# Altium project PowerStuff.PrjPcb
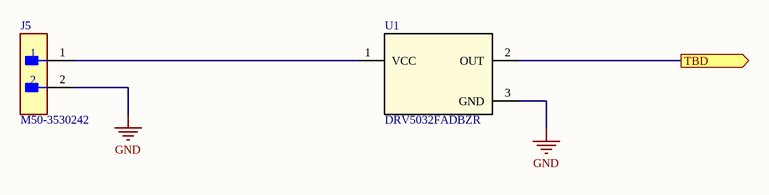
[diagram p0: HallSensor.SchDoc]
4 sheets, 56 parts. Net scope: flat (ports and power ports of the same name join across sheets).
Sheets:
  HallSensor.SchDoc
  ChargerIC.SchDoc
  Boost.SchDoc
  MotorDriver.SchDoc

## Sheet HallSensor.SchDoc
size A4; SheetNumber: 1; SheetTotal: 3

### Parts
J5  M50-3530242  [FP-M50-3530242-MFG]
U1  DRV5032FADBZR  [DBZ0003A-IPC_A]

### Ports
TBD (out)

### Nets
GND: J5.2 U1.3(GND)  [project net ADAPTER-]
NetJ5_1: J5.1 U1.1(VCC)
NetU1_2: U1.2(OUT) ; port TBD

### Library data of the parts
J5 = CMP-15831-000040-1: CONN HEADER VERT 2POS 1.27MM
U1 = DRV5032FADBZR: Low-power (5Hz, <1ÂµA) low-voltage (up to 5.5V) switch 3-SOT-23 -40 to 85; Manufacturer_Name: Texas Instruments; TYPE: TYPE; RefDes: RefDes; Copyright: Copyright (C) 2026 Ultra Librarian. All rights reserved.; Manufacturer_Part_Number: DRV5032FADBZR; Datasheet: https://www.ti.com/lit/gpn/drv5032

## Sheet ChargerIC.SchDoc
size A4; SheetNumber: 2; SheetTotal: 4
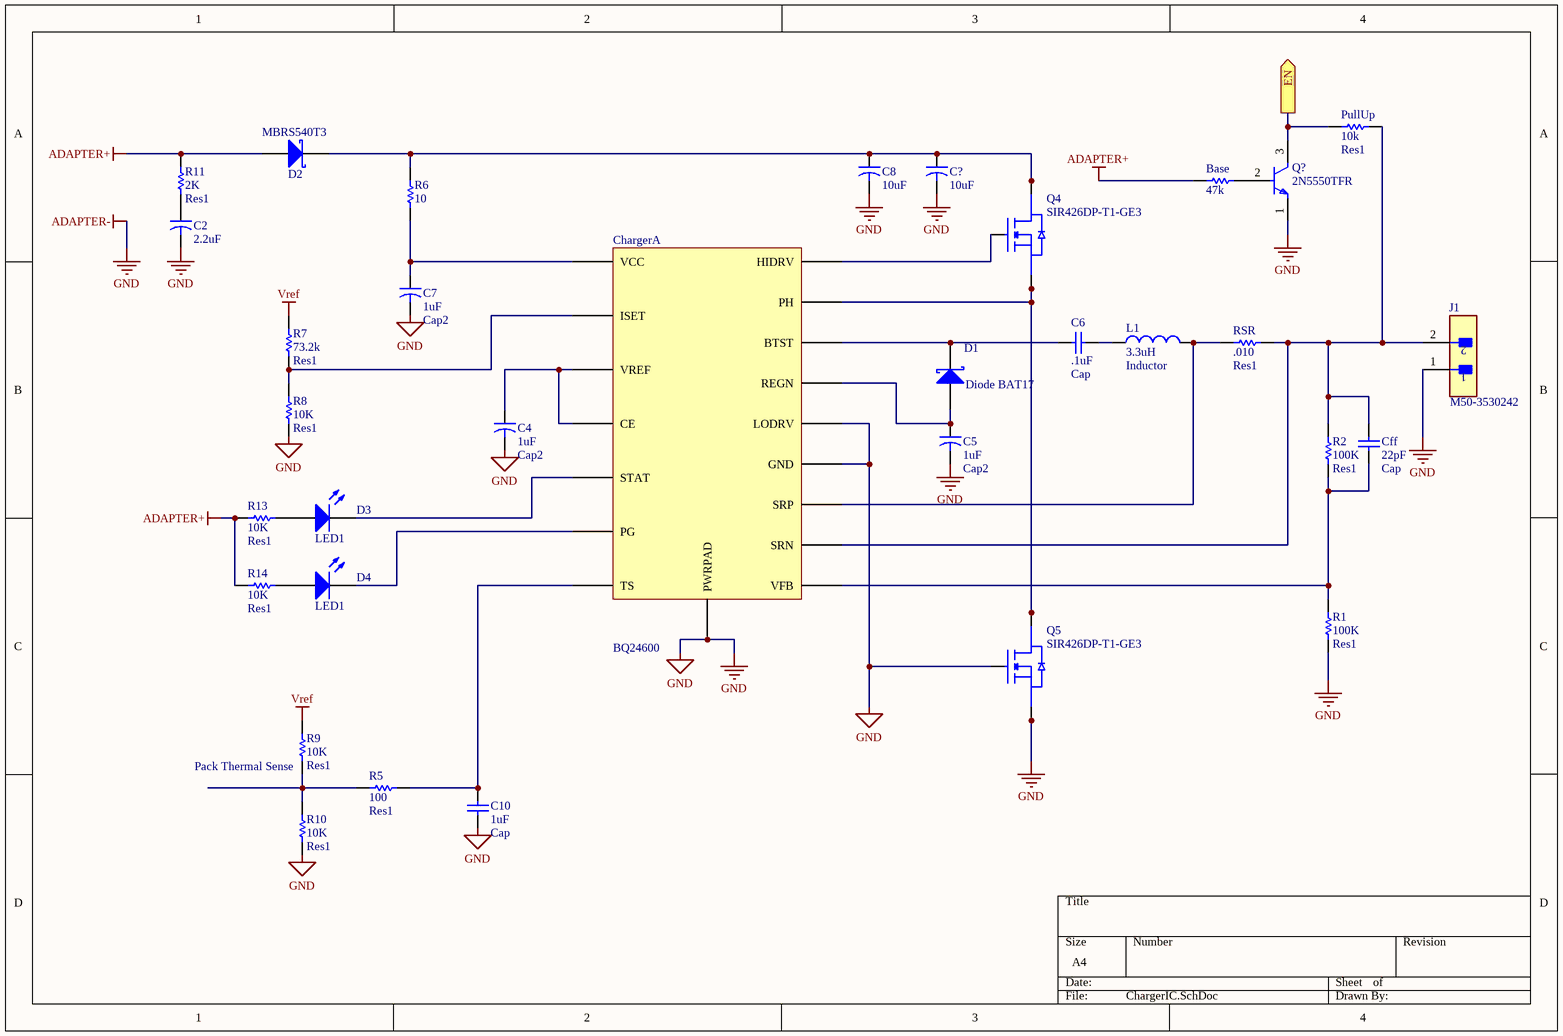
[diagram p1: ChargerIC.SchDoc]

### Parts
Base  value 47k  [AXIAL-0.3]  (hidden comment: Res1)
C2  value 2.2uF  [CAPR5-4X5]  (hidden comment: Cap2)
C4  Cap2  value 1uF  [CAPR5-4X5]
C5  Cap2  value 1uF  [CAPR5-4X5]
C6  Cap  value .1uF  [RAD-0.3]
C7  Cap2  value 1uF  [CAPR5-4X5]
C8  value 10uF  [CAPR5-4X5]  (hidden comment: Cap2)
C10  Cap  value 1uF  [RAD-0.3]
C?  value 10uF  [CAPR5-4X5]  (hidden comment: Cap2)
Cff  Cap  value 22pF  [RAD-0.3]
Charger  BQ24600  (part A of 2)
D1  Diode BAT17  [SOT-23_N]
D3  LED1  [LED-1]
D4  LED1  [LED-1]
J1  M50-3530242  [FP-M50-3530242-MFG]
L1  Inductor  L1: 3.3uH  [0402-A]
MBRS540T3  D2  [SMB]
PullUp  Res1  value 10k  [AXIAL-0.3]
Q4  SIR426DP-T1-GE3  [TRANS_SIRA90DP-T1-GE3]
Q5  SIR426DP-T1-GE3  [TRANS_SIRA90DP-T1-GE3]
Q?  2N5550TFR  [FP-135AR-MFG]
R1  Res1  value 100K  [AXIAL-0.3]
R2  Res1  value 100K  [AXIAL-0.3]
R5  Res1  value 100  [AXIAL-0.3]
R6  value 10  [AXIAL-0.3]  (hidden comment: 10Ohm)
R7  Res1  value 73.2k  [AXIAL-0.3]
R8  Res1  value 10K  [AXIAL-0.3]
R9  Res1  value 10K  [AXIAL-0.3]
R10  Res1  value 10K  [AXIAL-0.3]
R11  Res1  value 2K  [AXIAL-0.3]
R13  Res1  value 10K  [AXIAL-0.3]
R14  Res1  value 10K  [AXIAL-0.3]
RSR  Res1  value .010  [AXIAL-0.3]

### Ports
EN (out)

### Nets
ADAPTER+: Base.1 MBRS540T3.1(A) R11.1 R13.1 R14.1
ADAPTER-: C2.2 C4.2 C5.2 C7.2 C8.2 C10.1 C?.2 Charger.31(LODRV) Charger.32(GND) Charger.36(PWRPAD) J1.1 Q5.1(S) Q5.2(S) Q5.3(S) Q5.4(G) Q?.1(E) R1.1 R8.1 R10.2  [also labelled GND]
Vref: R7.2 R9.1
NetBase_2: Base.2 Q?.2(B)
NetC2_1: C2.1 R11.2
NetC4_1: C4.1 Charger.17(VREF) Charger.18(CE)
NetC5_1: C5.1 Charger.30(REGN) D1.1(A)
NetC6_1: C6.1 Charger.28(BTST) D1.3(K)
NetC6_2: C6.2 L1.1
NetC7_1: C7.1 Charger.15(VCC) R6.2
NetC8_1: C8.1 C?.1 MBRS540T3.2(K) Q4.5(D) Q4.6(D) Q4.7(D) Q4.8(D) Q4.9(D) R6.1
NetC10_2: C10.2 Charger.29(TS) R5.2
NetCff_1: Cff.1 Charger.35(VFB) R1.2 R2.1
NetCff_2: Cff.2 Charger.34(SRN) J1.2 PullUp.2 R2.2 RSR.2
NetCharger_16: Charger.16(ISET) R7.1 R8.2
NetCharger_19: Charger.19(STAT) D3.2(K)
NetCharger_20: Charger.20(PG) D4.2(K)
NetCharger_26: Charger.26(HIDRV) Q4.4(G)
NetCharger_27: Charger.27(PH) Q4.1(S) Q4.2(S) Q4.3(S) Q5.5(D) Q5.6(D) Q5.7(D) Q5.8(D) Q5.9(D)
NetCharger_33: Charger.33(SRP) L1.2 RSR.1
NetD3_1: D3.1(A) R13.2
NetD4_1: D4.1(A) R14.2
NetPullUp_1: PullUp.1 Q?.3(C) ; port EN
NetR5_1: R5.1 R9.2 R10.1

### Notes on the sheet
- (near R9) Pack Thermal Sense

### Library data of the parts
Base PullUp R1 R2 R5-R11 R13 R14 RSR = Res1: Resistor; Published: 8-Jun-2000; LatestRevisionDate: 17-Jul-2002; LatestRevisionNote: Re-released for DXP Platform.; PackageReference: AXIAL-0.3; Publisher: Altium Limited; PackageDescription: Axial Device, Thru-Hole; 2 Leads; 0.3 in Pin Spacing
C2 C4 C5 C7 C8 C? = Cap2: Capacitor; Published: 23-Sep-2002; PackageReference: CAPR5-4X5; Publisher: Altium Limited; PackageDescription: Capacitor; 2 Leads
C6 C10 Cff = Cap: Capacitor; Published: 8-Jun-2000; LatestRevisionDate: 17-Jul-2002; LatestRevisionNote: Re-released for DXP Platform.; PackageReference: RAD-0.3; Publisher: Altium Limited; PackageDescription: Radial Cap, Thru-Hole; 2 Leads; 0.3 in Pin Spacing
D1 = Diode BAT17: Silicon RF Schottky Diode for Mixer Applications in the VHF/UHF Range; Note: Pin 2 is not connected and not drawn.; Published: 21-Mar-2003; LatestRevisionDate: 29-May-2009; LatestRevisionNote: IPC-7351 Footprint Added.; DatasheetVersion: Oct-1999; PackageVersion: Sep-2001; PackageReference: SOT-23; Publisher: Altium Limited; PackageDescription: 3-Pin SOT-23 Package 0.95 mm Pitch, 2.5 mm Lead Span; ComponentLink1Description: Manufacturer Link; ComponentLink1URL: http://www.infineon.com/; ComponentLink2Description: Datasheet; ComponentLink2URL: http://www.infineon.com/upload/Document/cmc_upload/documents/009/363/bat17series.pdf
D3 D4 = LED1: Typical RED GaAs LED; Published: 8-Jun-2000; LatestRevisionDate: 08-Jul-2005; LatestRevisionNote: Mech Layer 1 removed.; PackageReference: LED-1; Publisher: Altium Limited; PackageDescription: LED; 2 Leads
J1 = CMP-15831-000040-1: CONN HEADER VERT 2POS 1.27MM
L1 = Inductor: Code_IEC: 1005; Published: 8-Jun-2000; LatestRevisionDate: 29-May-2009; LatestRevisionNote: IPC-7351 Footprint Added.; PackageReference: 0402-A; Publisher: Altium Limited; PackageDescription: Chip Inductor; Code_JEITA: 0402
MBRS540T3 = D Schottky: Schottky Diode; Published: 8-Jun-2000; LatestRevisionDate: 17-Jul-2002; LatestRevisionNote: Re-released for DXP Platform.; PackageReference: SMB; Publisher: Altium Limited; PackageDescription: DO-214-AA/SMB; 2 C-Bend Leads; Body 5.3 x 3.6 mm, inc. leads (LxW); Code_JEDEC: DO-214-AA
Q4 Q5 = SIR426DP-T1-GE3: 40V 30A 41.7W 10.5mohm @ 10V | Siliconix / Vishay SIR426DP-T1-GE3; MF: Vishay Siliconix; SnapEDA_Link: https://www.snapeda.com/parts/SIR426DP-T1-GE3/Vishay/view-part/?ref=snap; Package: PowerPAK SO-8 Vishay; Value: *; MP: SIR426DP-T1-GE3; Check_prices: https://www.snapeda.com/parts/SIR426DP-T1-GE3/Vishay/view-part/?ref=eda
Q? = CMP-00278-84408887-1: 2N5550TFR Transistor, bjt, npn, 140V V(Br)Ceo, 600Ma I(C), to-92 Rohs Compliant: Yes; Manufacturer Lifecycle Status: ACTIVE; Gain Bandwidth Product: 300MHz; Max Power Dissipation: 625mW; hFE Min: 60; Emitter Base Voltage (VEBO): 6V; Max Junction Temperature (Tj): 150°C; Number of Elements: 1; Collector Emitter Saturation Voltage: 250mV; Element Configuration: Single; Collector Base Voltage (VCBO): 160V; Min Operating Temperature: -55°C; Case/Package: TO-92-3; Weight: 240mg; Max Frequency: 300MHz; NexarPartId: 84408887; Schedule B: 8541210080, 8541210080; Voltage Rating (DC): 140V; Lifecycle Status: Production; Mount: Through Hole; Polarity: NPN; Radiation Hardening: No; Power Dissipation: 625mW; Transition Frequency: 300MHz; RoHS: Compliant; Max Breakdown Voltage: 140V; Frequency: 300MHz; Length: 4.58mm; Current Rating: 600mA; Width: 3.86mm; Collector Emitter Voltage (VCEO): 140V; Max Operating Temperature: 150°C; Lead Free: Lead Free; Collector Emitter Breakdown Voltage: 140V; Height: 4.58mm; Max Collector Current: 600mA; Number of Pins: 3

## Sheet Boost.SchDoc
size A4; SheetNumber: 3; SheetTotal: 4
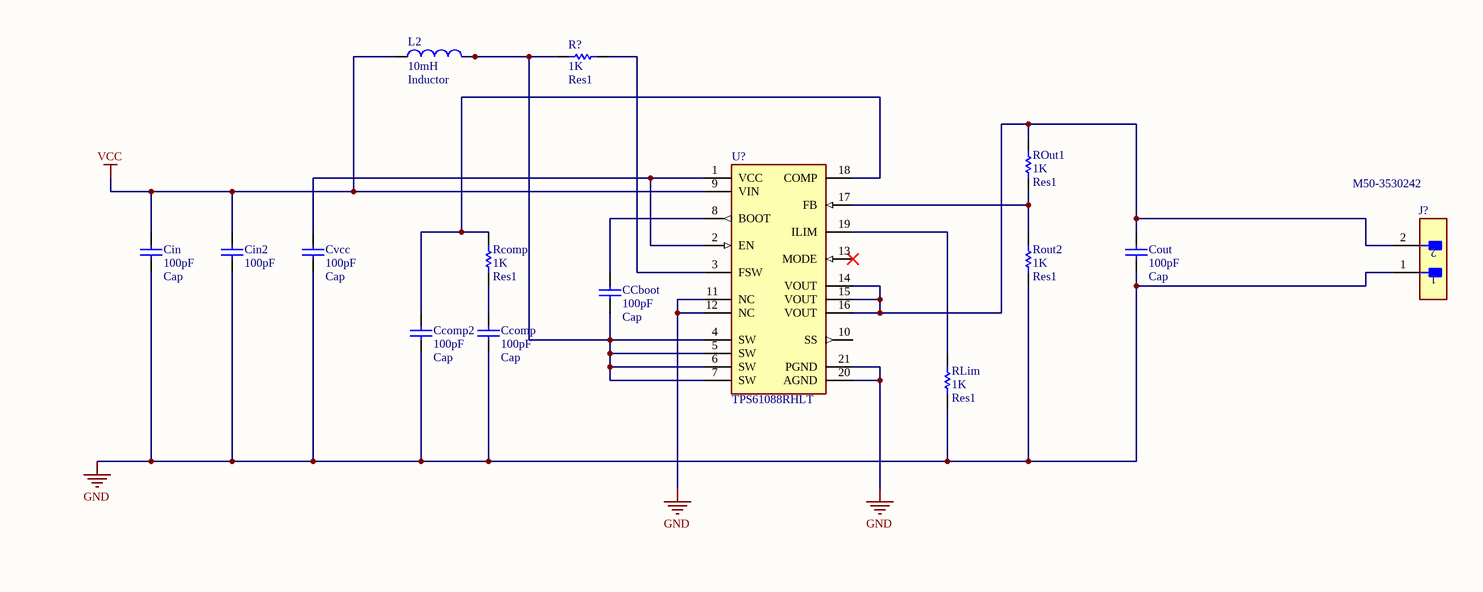
[diagram p2: Boost.SchDoc, right]

### Parts
CCboot  Cap  value 100pF  [RAD-0.3]
Ccomp  Cap  value 100pF  [RAD-0.3]
Ccomp2  Cap  value 100pF  [RAD-0.3]
Cin  Cap  value 100pF  [RAD-0.3]
Cin2  value 100pF  [RAD-0.3]
Cout  Cap  value 100pF  [RAD-0.3]
Cvcc  Cap  value 100pF  [RAD-0.3]
J?  M50-3530242  [FP-M50-3530242-MFG]
L2  Inductor  value 10mH  [0402-A]
R?  Res1  value 1K  [AXIAL-0.3]
Rcomp  Res1  value 1K  [AXIAL-0.3]
RLim  Res1  value 1K  [AXIAL-0.3]
ROut1  Res1  value 1K  [AXIAL-0.3]
Rout2  Res1  value 1K  [AXIAL-0.3]
U?  TPS61088RHLT  [FP-RHL0020A-MFG]

### Nets
GND: Ccomp.1 Ccomp2.1 Cin.1 Cin2.1 Cout.1 Cvcc.1 J?.1 RLim.1 Rout2.1 U?.11(NC) U?.12(NC) U?.20(AGND) U?.21(PGND)  [project net ADAPTER-]
VCC: Cin.2 Cin2.2 L2.1 U?.9(VIN)
NetCCboot_1: CCboot.1 L2.2 R?.2 U?.4(SW) U?.5(SW) U?.6(SW) U?.7(SW)
NetCCboot_2: CCboot.2 U?.8(BOOT)
NetCcomp2_2: Ccomp2.2 Rcomp.2 U?.18(COMP)
NetCcomp_2: Ccomp.2 Rcomp.1
NetCout_2: Cout.2 J?.2 ROut1.2 U?.14(VOUT) U?.15(VOUT) U?.16(VOUT)
NetCvcc_2: Cvcc.2 U?.1(VCC) U?.2(EN)
NetR?_1: R?.1 U?.3(FSW)
NetRLim_2: RLim.2 U?.19(ILIM)
NetROut1_1: ROut1.1 Rout2.2 U?.17(FB)

Not connected (* = marked no-connect by the designer): U? 10(SS) 13(MODE)*

### Library data of the parts
CCboot Ccomp Ccomp2 Cin Cin2 Cout Cvcc = Cap: Capacitor; Published: 8-Jun-2000; LatestRevisionDate: 17-Jul-2002; LatestRevisionNote: Re-released for DXP Platform.; PackageReference: RAD-0.3; Publisher: Altium Limited; PackageDescription: Radial Cap, Thru-Hole; 2 Leads; 0.3 in Pin Spacing
J? = CMP-15831-000040-1: CONN HEADER VERT 2POS 1.27MM
L2 = Inductor: Code_IEC: 1005; Published: 8-Jun-2000; LatestRevisionDate: 29-May-2009; LatestRevisionNote: IPC-7351 Footprint Added.; PackageReference: 0402-A; Publisher: Altium Limited; PackageDescription: Chip Inductor; Code_JEITA: 0402
R? Rcomp RLim ROut1 Rout2 = Res1: Resistor; Published: 8-Jun-2000; LatestRevisionDate: 17-Jul-2002; LatestRevisionNote: Re-released for DXP Platform.; PackageReference: AXIAL-0.3; Publisher: Altium Limited; PackageDescription: Axial Device, Thru-Hole; 2 Leads; 0.3 in Pin Spacing
U? = CMP-04918-000117-1: IC REG BOOST ADJ 10A 20VQFN; Manufacturer: Texas Instruments; Output Voltage: 4.5-12.6V; Max Junction Temp: +125°C; Max Duty Cycle: 90%; Output Type: AdjustableProgrammable; Nominal Supply Current: 1-110uA; Min Supply Voltage: 2.7V; Switching Frequency: 200-2200kHz; Number Of Outputs: 1; Max Supply Voltage: 12V; Manufacturer Part Number: TPS61088RHLT; Digikey Description: IC REG BOOST ADJ 10A 20VQFN; Octopart: https://octopart.com/tps61088rhlt-texas+instruments-57155059; Switching Topology: Boost; Lead Free: Yes; Output Current: 10A; Height: 1mm; Temperature: -40°C to +85°C; Package: RHL0020A; Device Class L3: Voltage Regulators - Switching; RoHS: TRUE; Temperature Range Low: -40°C; Temperature Range High: +85°C; Device Class L1: Integrated Circuits (ICs); Automotive: No; Category: IC; ComponentLink2Description: Datasheet; ComponentLink2URL: http://www.ti.com/lit/ds/symlink/tps61088.pdf; Device Class L2: Power Management ICs

## Sheet MotorDriver.SchDoc
size A4; SheetNumber: 4; SheetTotal: 4
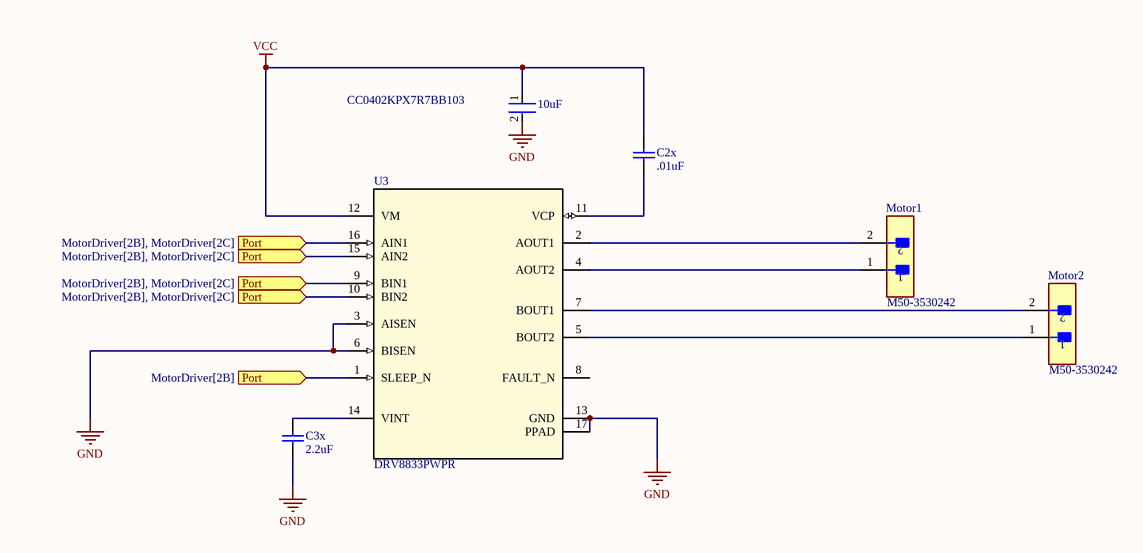
[diagram p3: MotorDriver.SchDoc]

### Parts
10uF  CC0402KPX7R7BB103  [FP-CC0402-MFG]
C2x  value .01uF  (hidden comment: Capacitor)
C3x  value 2.2uF  (hidden comment: Capacitor)
Motor1  M50-3530242  [FP-M50-3530242-MFG]
Motor2  M50-3530242  [FP-M50-3530242-MFG]
U3  DRV8833PWPR  [PWP0016C_N]

### Ports
Port (in, see MotorDriver[2B]), Port (in, see MotorDriver[2B], MotorDriver[2C])

### Nets
GND: 10uF.2 C3x.1 U3.3(AISEN) U3.6(BISEN) U3.13(GND) U3.17(PPAD)  [project net ADAPTER-]
VCC: 10uF.1 C2x.2 U3.12(VM)
NetC2x_1: C2x.1 U3.11(VCP)
NetC3x_2: C3x.2 U3.14(VINT)
NetMotor1_1: Motor1.1 U3.4(AOUT2)
NetMotor1_2: Motor1.2 U3.2(AOUT1)
NetMotor2_1: Motor2.1 U3.5(BOUT2)
NetMotor2_2: Motor2.2 U3.7(BOUT1)
NetU3_1: U3.1(SLEEP_N) U3.9(BIN1) U3.10(BIN2) U3.15(AIN2) U3.16(AIN1) ; port Port

Not connected (* = marked no-connect by the designer): U3 8(FAULT_N)

### Library data of the parts
10uF = CMP-03422-000420-1: CC0402 10 nF X7R 10.00% 16 V; Manufacturer: YAGEO; Capacitance: 10 nF; Value: 10 nF; Tolerance: 0.1; Voltage Rating: 16 V; Automotive Grade: NA; Temperature Coefficient: 30ppm/°C; Automotive: No; Device Class L1: Passive Components; Temperature Range Low: -55°C; Ipc Land Pattern Name: CAPC10050X50; Temperature Characteristic: X7R; Lead Free: Yes; Footprint Url: http://www.yageo.com/exep/pages/download/literatures/UPY-C_GEN_24.pdf; Octopart: https://octopart.com/cc0402kpx7r7bb103-yageo-12885102; RoHS: TRUE; Height: 0.55mm; Device Class L3: Ceramic Capacitors; Mouser Description: Multilayer Ceramic Capacitors MLCC - SMD/SMT 10nF 16V X7R 10%; Package: CC0402; ComponentLink2Description: Datasheet; Category: Cap; Material: Ceramic; ComponentLink2URL: http://www.yageo.com/documents/recent/UPY-GP_NP0_16V-to-50V_16.pdf; Temperature: -55°C to +125°C; Manufacturer Part Number: CC0402KPX7R7BB103; Temperature Range High: +125°C; Device Class L2: Capacitors
C2x C3x = Capacitor: SimulationGenericComponent: True
Motor1 Motor2 = CMP-15831-000040-1: CONN HEADER VERT 2POS 1.27MM
U3 = DRV8833PWPR: 10.8-V, 2-A dual H-bridge motor driver with current regulation 16-HTSSOP -40 to 85; Manufacturer_Name: Texas Instruments; TYPE: TYPE; RefDes: RefDes; Copyright: Copyright (C) 2025 Ultra Librarian. All rights reserved.; Manufacturer_Part_Number: DRV8833PWPR

## Nets that join several sheets
ADAPTER-: HallSensor (J5.2 U1.3), ChargerIC (19 pins), Boost (13 pins), MotorDriver (6 pins)
VCC: Boost (Cin.2 Cin2.2 L2.1 U?.9), MotorDriver (10uF.1 C2x.2 U3.12)